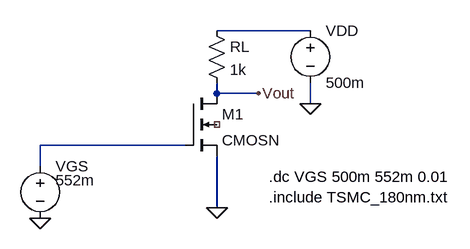
[diagram p0: schematic 5l(a).asc]
5l(a).asc, the LTspice schematic file:
Version 4
SHEET 1 880 680
WIRE 480 160 336 160
WIRE 336 256 336 240
WIRE 400 256 336 256
WIRE 480 272 480 240
WIRE 288 336 64 336
WIRE 64 368 64 336
WIRE 336 432 336 352
FLAG 64 448 0
FLAG 336 432 0
FLAG 480 272 0
FLAG 400 256 Vout
SYMBOL nmos4 288 256 R0
SYMATTR InstName M1
SYMATTR Value CMOSN
SYMATTR Value2 l=0.18u w=1u ad=0.45p as=0.45p pd=2.9u ps=2.9u
SYMBOL voltage 480 144 R0
SYMATTR InstName VDD
SYMATTR Value 500m
SYMBOL voltage 64 352 R0
WINDOW 3 24 38 Left 2
SYMATTR Value 552m
SYMATTR InstName VGS
SYMBOL res 320 144 R0
SYMATTR InstName RL
SYMATTR Value 1k
TEXT 416 384 Left 2 !.dc VGS 500m 552m 0.01
TEXT 416 416 Left 2 !.include TSMC_180nm.txt

The netlist it stands for:
* 5l(a).asc
M1 Vout N002 0 NC_01 CMOSN l=0.18u w=1u ad=0.45p as=0.45p pd=2.9u ps=2.9u
VDD N001 0 500m
VGS N002 0 552m
RL N001 Vout 1k
.model NMOS NMOS
.model PMOS PMOS
.lib standard.mos
.dc VGS 500m 552m 0.01
.include TSMC_180nm.txt
.backanno
.end